# Altium schematic sheet 03 MCU.SchDoc
size 420 x 297 mm
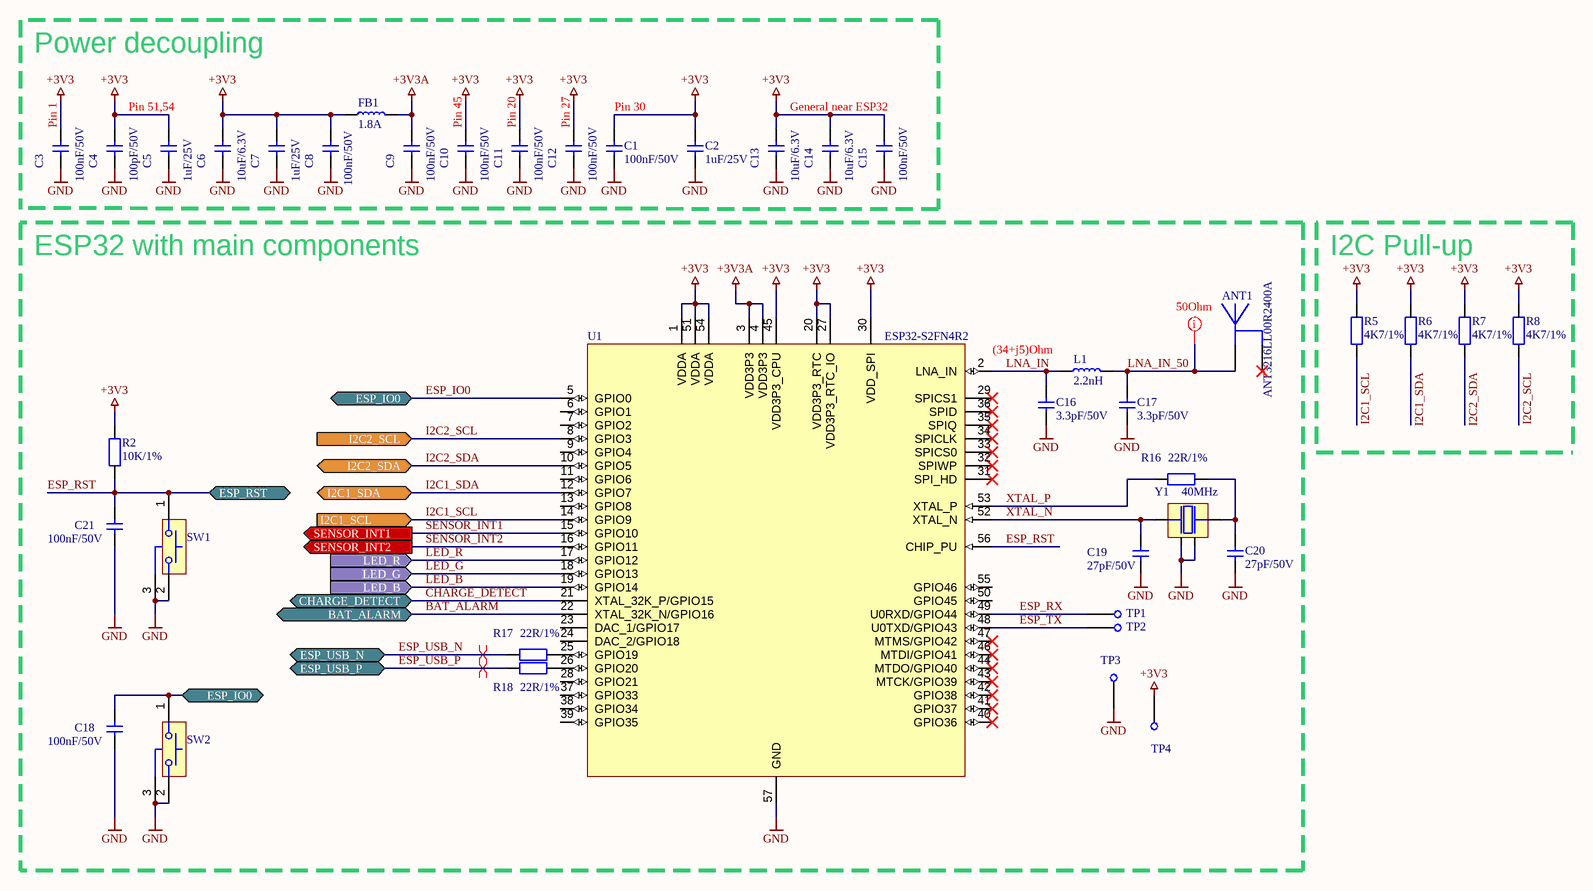
[diagram p0: 03 MCU.SchDoc]

## Parts
ANT1  ANT3216LL00R2400A  [INDC3216X14N]
C1  100nF/50V  [CAPC1005X06N]
C2  1uF/25V  [CAPC1005X06N]
C3  100nF/50V  [CAPC1005X06N]
C4  100pF/50V  [CAPC1005X06N]
C5  1uF/25V  [CAPC1005X06N]
C6  10uF/6.3V  [CAPC1005X06N]
C7  1uF/25V  [CAPC1005X06N]
C8  100nF/50V  [CAPC1005X06N]
C9  100nF/50V  [CAPC1005X06N]
C10  100nF/50V  [CAPC1005X06N]
C11  100nF/50V  [CAPC1005X06N]
C12  100nF/50V  [CAPC1005X06N]
C13  10uF/6.3V  [CAPC1005X06N]
C14  10uF/6.3V  [CAPC1005X06N]
C15  100nF/50V  [CAPC1005X06N]
C16  3.3pF/50V  [CAPC1005X06N]
C17  3.3pF/50V  [CAPC1005X06N]
C18  100nF/50V  [CAPC1005X06N]
C19  27pF/50V  [CAPC1005X06N]
C20  27pF/50V  [CAPC1005X06N]
C21  100nF/50V  [CAPC1005X06N]
FB1  1.8A  [INDC1608X10N]
L1  2.2nH  [INDC1005X05N]
R2  10K/1%  [RESC1005X04N]
R5  4K7/1%  [RESC1005X04N]
R6  4K7/1%  [RESC1005X04N]
R7  4K7/1%  [RESC1005X04N]
R8  4K7/1%  [RESC1005X04N]
R16  22R/1%  [RESC1005X04N]
R17  22R/1%  [RESC1005X04N]
R18  22R/1%  [RESC1005X04N]
SW1  PUSH BUTTON SMD  [1TS003B-1400-3500A-CT]  (value not drawn)
SW2  PUSH BUTTON SMD  [1TS003B-1400-3500A-CT]  (value not drawn)
TP1  Test Point 1mm  [TEST_POINT_1mm]  (value not drawn)
TP2  Test Point 1mm  [TEST_POINT_1mm]  (value not drawn)
TP3  Test Point 1mm  [TEST_POINT_1mm]  (value not drawn)
TP4  Test Point 1mm  [TEST_POINT_1mm]  (value not drawn)
U1  ESP32-S2FN4R2  [QFN40P700X700X90_HS-57N]
Y1  40MHz  [7E40000E15UCG]

## Blocks framed on the sheet
ESP32 with main components: ANT1 C16-C21 L1 R2 R16-R18 SW1 SW2 TP1-TP4 U1 Y1
I2C Pull-up: R5-R8

## Ports
BAT_ALARM (bidir), CHARGE_DETECT (bidir), ESP_IO0 (bidir), ESP_RST (bidir), ESP_USB_N (bidir), ESP_USB_P (bidir), I2C1_SCL (in), I2C1_SDA (bidir), I2C2_SCL (in), I2C2_SDA (bidir), LED_B (in), LED_G (in), LED_R (in), SENSOR_INT1 (out), SENSOR_INT2 (out)

## Nets
+3V3: C1.2 C2.2 C3.2 C4.2 C5.2 C6.2 C7.2 C8.2 C10.2 C11.2 C12.2 C13.1 C14.1 C15.2 FB1.1 R2.1 R5.2 R6.2 R7.2 R8.2 TP4.1 U1.1(VDDA) U1.20(VDD3P3_RTC) U1.27(VDD3P3_RTC_IO) U1.30(VDD_SPI) U1.45(VDD3P3_CPU) U1.51(VDDA) U1.54(VDDA)
+3V3A: C9.2 FB1.2 U1.3(VDD3P3) U1.4(VDD3P3)
GND: C1.1 C2.1 C3.1 C4.1 C5.1 C6.1 C7.1 C8.1 C9.1 C10.1 C11.1 C12.1 C13.2 C14.2 C15.1 C16.1 C17.1 C18.1 C19.1 C20.1 C21.1 SW1.2 SW1.3 SW2.2 SW2.3 TP3.1 U1.57(GND) Y1.2 Y1.4
BAT_ALARM: U1.22(XTAL_32K_N/GPIO16) ; port BAT_ALARM
CHARGE_DETECT: U1.21(XTAL_32K_P/GPIO15) ; port CHARGE_DETECT
ESP_IO0: C18.2 SW2.1 U1.5(GPIO0) ; port ESP_IO0
ESP_RST: C21.2 R2.2 SW1.1 U1.56(CHIP_PU) ; port ESP_RST
ESP_RX: TP1.1 U1.49(U0RXD/GPIO44)
ESP_TX: TP2.1 U1.48(U0TXD/GPIO43)
ESP_USB_N: R17.1 ; port ESP_USB_N
ESP_USB_P: R18.1 ; port ESP_USB_P
I2C1_SCL: R5.1 U1.14(GPIO9) ; port I2C1_SCL
I2C1_SDA: R6.1 U1.12(GPIO7) ; port I2C1_SDA
I2C2_SCL: R8.1 U1.8(GPIO3) ; port I2C2_SCL
I2C2_SDA: R7.1 U1.10(GPIO5) ; port I2C2_SDA
LED_B: U1.19(GPIO14) ; port LED_B
LED_G: U1.18(GPIO13) ; port LED_G
LED_R: U1.17(GPIO12) ; port LED_R
LNA_IN: C16.2 L1.1 U1.2(LNA_IN)
LNA_IN_50: ANT1.1 C17.2 L1.2
SENSOR_INT1: U1.15(GPIO10) ; port SENSOR_INT1
SENSOR_INT2: U1.16(GPIO11) ; port SENSOR_INT2
XTAL_N: C19.2 U1.52(XTAL_N) Y1.1
XTAL_P: R16.1 U1.53(XTAL_P)
NetC20_2: C20.2 R16.2 Y1.3
NetR17_2: R17.2 U1.25(GPIO19)
NetR18_2: R18.2 U1.26(GPIO20)

Not connected (* = marked no-connect by the designer): ANT1 2*; U1 6(GPIO1) 7(GPIO2) 9(GPIO4) 11(GPIO6) 13(GPIO8) 23(DAC_1/GPIO17) 24(DAC_2/GPIO18) 28(GPIO21) 29(SPICS1)* 31(SPI_HD)* 32(SPIWP)* 33(SPICS0)* 34(SPICLK)* 35(SPIQ)* 36(SPID)* 37(GPIO33) 38(GPIO34) 39(GPIO35) 40(GPIO36)* 41(GPIO37)* 42(GPIO38)* 43(MTCK/GPIO39)* 44(MTDO/GPIO40)* 46(MTDI/GPIO41)* 47(MTMS/GPIO42)* 50(GPIO45) 55(GPIO46)

## Layout directives
net class 50Ohm: LNA_IN_50
differential pair; differential pair class USB: ESP_USB_N, ESP_USB_P

## Notes on the sheet
- Power decoupling
- (near C3) Pin 1
- Pin 51,54
- (near C10) Pin 45
- (near C11) Pin 20
- (near C12) Pin 27
- (near C1) Pin 30
- General near ESP32
- (34+j5)Ohm
- Title
- Project
- Size
- Date
- Revision
- A3

## Library data of the parts
ANT1 = ANT3216LL00R2400A: 1206  Antennas ROHS; manufacturer: YAGEO; assembler_number: C293767; mfr_part_number: ANT3216LL00R2400A; datasheet: https://datasheet.lcsc.com/lcsc/1810241140_YAGEO-ANT3216LL00R2400A_C293767.pdf
C1 C3 C8-C12 C15 C18 C21 = CL05B104KO5NNNC: 16V 100nF X7R ±10% 0402  Multilayer Ceramic Capacitors MLCC - SMD/SMT ROHS; manufacturer: Samsung Electro-Mechanics; assembler_number: C1525; mfr_part_number: CL05B104KO5NNNC; datasheet: https://datasheet.lcsc.com/lcsc/1810191219_Samsung-Electro-Mechanics-CL05B104KO5NNNC_C1525.pdf
C2 C5 C7 = CL05A105KA5NQNC: 25V 1uF X5R ±10% 0402  Multilayer Ceramic Capacitors MLCC - SMD/SMT ROHS; manufacturer: Samsung Electro-Mechanics; assembler_number: C52923; mfr_part_number: CL05A105KA5NQNC; datasheet: https://datasheet.lcsc.com/lcsc/1811091611_Samsung-Electro-Mechanics-CL05A105KA5NQNC_C52923.pdf
C4 = 0402CG101J500NT: 50V 100pF C0G ±5% 0402  Multilayer Ceramic Capacitors MLCC - SMD/SMT ROHS; manufacturer: FH (Guangdong Fenghua Advanced Tech); assembler_number: C1546; mfr_part_number: 0402CG101J500NT; datasheet: https://datasheet.lcsc.com/lcsc/1810151218_FH--Guangdong-Fenghua-Advanced-Tech-0402CG101J500NT_C1546.pdf
C6 C13 C14 = CL05A106MQ5NUNC: 6.3V 10uF X5R ±20% 0402  Multilayer Ceramic Capacitors MLCC - SMD/SMT ROHS; manufacturer: Samsung Electro-Mechanics; assembler_number: C15525; mfr_part_number: CL05A106MQ5NUNC; datasheet: https://datasheet.lcsc.com/lcsc/2208231630_Samsung-Electro-Mechanics-CL05A106MQ5NUNC_C15525.pdf
C16 C17 = 0402CG3R3C500NT: 50V 3.3pF C0G ±0.25pF 0402  Multilayer Ceramic Capacitors MLCC - SMD/SMT ROHS; manufacturer: FH (Guangdong Fenghua Advanced Tech); assembler_number: C1565; mfr_part_number: 0402CG3R3C500NT; datasheet: https://datasheet.lcsc.com/lcsc/1811141710_FH--Guangdong-Fenghua-Advanced-Tech-0402CG3R3C500NT_C1565.pdf
C19 C20 = 0402CG270J500NT: 50V 27pF C0G ±5% 0402  Multilayer Ceramic Capacitors MLCC - SMD/SMT ROHS; manufacturer: FH (Guangdong Fenghua Advanced Tech); assembler_number: C1557; mfr_part_number: 0402CG270J500NT; datasheet: https://datasheet.lcsc.com/lcsc/1811141710_FH--Guangdong-Fenghua-Advanced-Tech-0402CG270J500NT_C1557.pdf
FB1 = UPZ1608G300-1R8TF: 1.8A 1 60mΩ 30Ω@100MHz ±25% 0603  Ferrite Beads ROHS; manufacturer: Sunlord; assembler_number: C919159; mfr_part_number: UPZ1608G300-1R8TF; datasheet: https://datasheet.lcsc.com/lcsc/2110100030_Sunlord-UPZ1608G300-1R8TF_C919159.pdf
L1 = CLH1005T-2N2S-S: 400mA 2.2nH ±0.3nH 120mΩ 0402  Inductors (SMD) ROHS; manufacturer: Chilisin Elec; assembler_number: C108254; mfr_part_number: CLH1005T-2N2S-S; datasheet: https://datasheet.lcsc.com/lcsc/1811141627_Chilisin-Elec-CLH1005T-2N2S-S_C108254.pdf
R2 = 0402WGF1002TCE: 62.5mW Thick Film Resistors 50V ±100ppm/℃ ±1% -55℃~+155℃ 10kΩ 0402  Chip Resistor - Surface Mount ROHS; manufacturer: UNI-ROYAL(Uniroyal Elec); assembler_number: C25744; mfr_part_number: 0402WGF1002TCE; datasheet: https://datasheet.lcsc.com/lcsc/2206010100_UNI-ROYAL-Uniroyal-Elec-0402WGF1002TCE_C25744.pdf
R5-R8 = CR-02FL6---4K7: 62.5mW Thick Film Resistors 50V ±100ppm/℃ ±1% -55℃~+155℃ 4.7kΩ 0402  Chip Resistor - Surface Mount ROHS; manufacturer: Viking Tech; assembler_number: C406732; mfr_part_number: CR-02FL6---4K7; datasheet: https://datasheet.lcsc.com/lcsc/1912111437_Viking-Tech-CR-02FL6---4K7_C406732.pdf
R16-R18 = 0402WGF220JTCE: 62.5mW Thick Film Resistors 50V ±1% ±200ppm/℃ -55℃~+155℃ 22Ω 0402  Chip Resistor - Surface Mount ROHS; manufacturer: UNI-ROYAL(Uniroyal Elec); assembler_number: C25092; mfr_part_number: 0402WGF220JTCE; datasheet: https://datasheet.lcsc.com/lcsc/2205311900_UNI-ROYAL-Uniroyal-Elec-0402WGF220JTCE_C25092.pdf
SW1 SW2 = 1TS003B-1400-3500A-CT: No NO 0.6W J pin 50mA 4.6mm 100MΩ 50000 140gf@±30gf 12V -40℃~+90℃ 1.82mm 3.5mm Black Rectangle button Surface Mount SPST SMD,4.6x1.82x3.5mm  Tactile Switches ROHS; manufacturer: HYP (Hongyuan Precision); assembler_number: C319392; mfr_part_number: 1TS003B-1400-3500A-CT; datasheet: https://datasheet.lcsc.com/lcsc/1811070920_HYP--Hongyuan-Precision-1TS003B-1400-3500A-CT_C319392.pdf
TP1-TP4 = TestPoint
U1 = ESP32-S2FN4R2: QFN-56  RF Modules ROHS; manufacturer: Espressif Systems; assembler_number: C2844252; mfr_part_number: ESP32-S2FN4R2; datasheet: https://datasheet.lcsc.com/lcsc/2203261130_Espressif-Systems-ESP32-S2FN4R2_C2844252.pdf
Y1 = 7E40000E15UCG: 40MHz SMD Crystal Resonator 15pF ±10ppm ±30ppm -40℃~+85℃ SMD2520-4P  Crystals ROHS; manufacturer: SJK(SHENZHEN CRYSTAL TECH); assembler_number: C524681; mfr_part_number: 7E40000E15UCG; datasheet: https://datasheet.lcsc.com/lcsc/2207271530_SJK-SHENZHEN-CRYSTAL-TECH-7E40000E15UCG_C524681.pdf